# EAGLE schematic Diagrama1 (EAGLE 9.4.2)
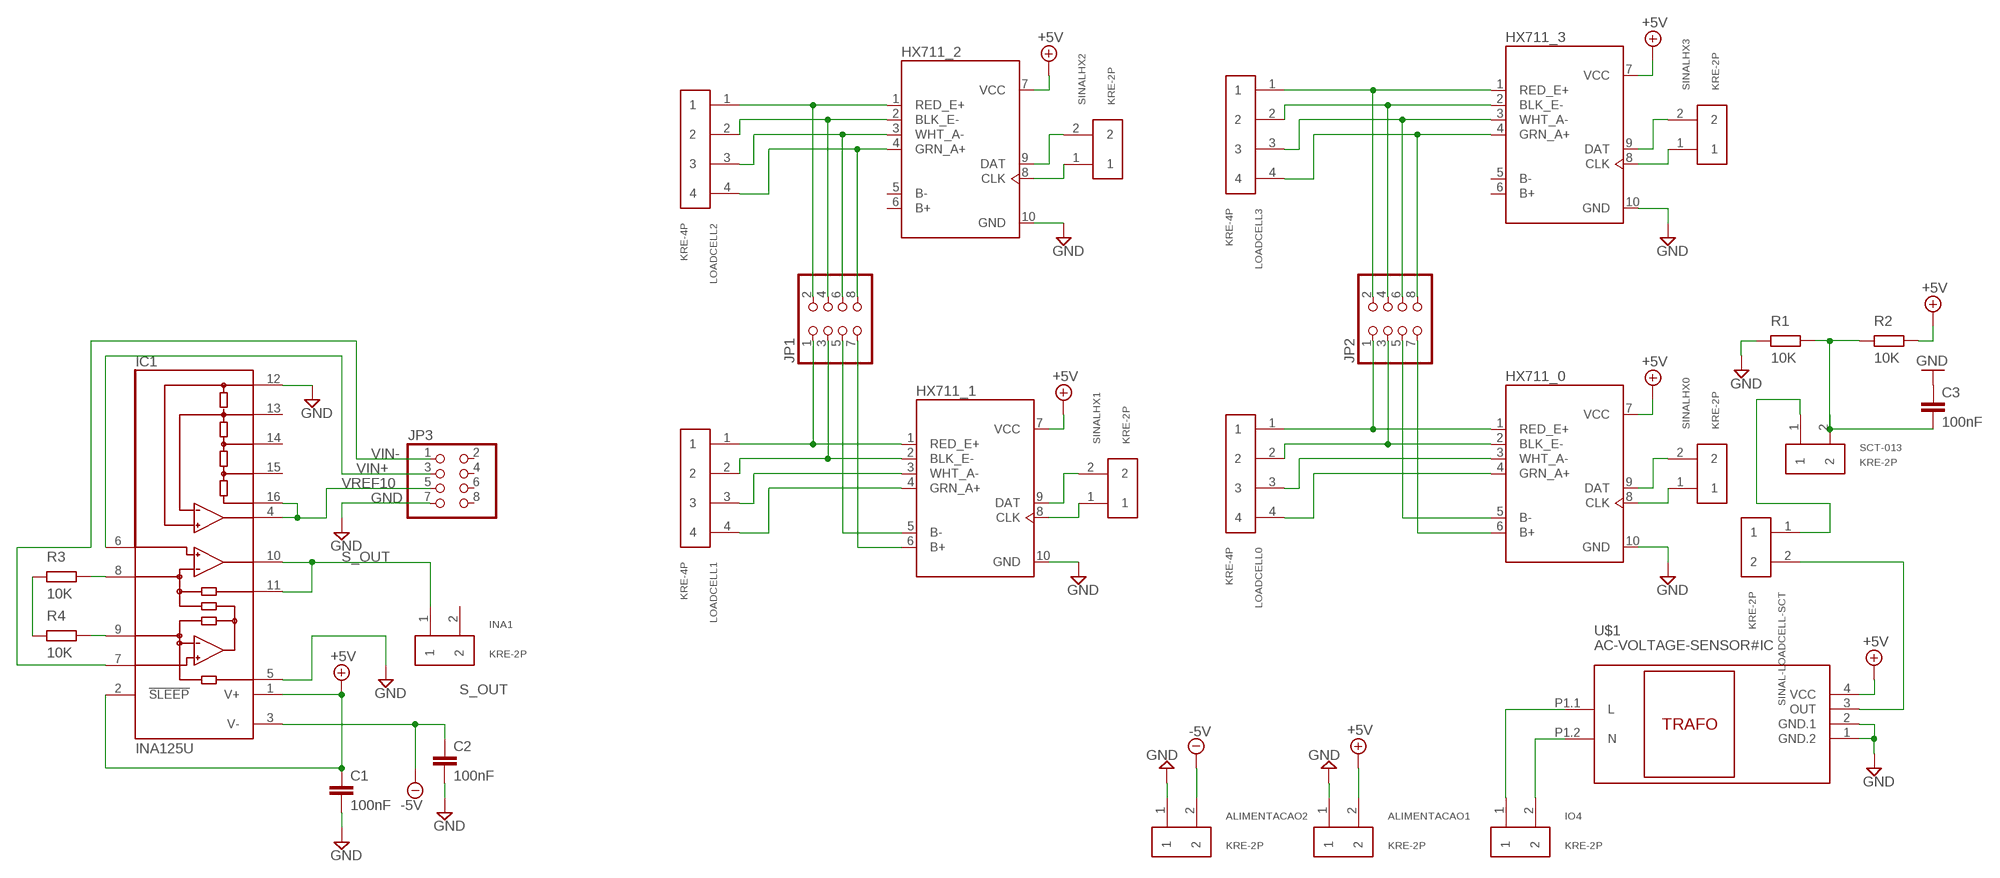
[diagram p0: schematic, sheet 1]

## Parts
ALIMENTACAO1  KRE-2P  [KRE-2P]
ALIMENTACAO2  KRE-2P  [KRE-2P]
C1  100nF  C-EU050-025X075  [C050-025X075]
C2  100nF  C-EU050-025X075  [C050-025X075]
C3  100nF  C-EU050-025X075  [C050-025X075]
HX711_0  HX711MODULO  [HX711MODULO]
HX711_1  HX711MODULO  [HX711MODULO]
HX711_2  HX711MODULO  [HX711MODULO]
HX711_3  HX711MODULO  [HX711MODULO]
IC1  INA125U  [SO16-1]
INA1  KRE-2P  [KRE-2P]
IO4  KRE-2P  [KRE-2P]
JP1  PINHD-2X4  [2X04]
JP2  PINHD-2X4  [2X04]
JP3  PINHD-2X4  [2X04]
LOADCELL0  KRE-4P  [KRE-4P]
LOADCELL1  KRE-4P  [KRE-4P]
LOADCELL2  KRE-4P  [KRE-4P]
LOADCELL3  KRE-4P  [KRE-4P]
R1  10K  1K1/4RESISTOR  [1/4W-0.41K]
R2  10K  1K1/4RESISTOR  [1/4W-0.41K]
R3  10K  1K1/4RESISTOR  [1/4W-0.41K]
R4  10K  1K1/4RESISTOR  [1/4W-0.41K]
SCT-013  KRE-2P  [KRE-2P]
SINAL-LOADCELL-SCT  KRE-2P  [KRE-2P]
SINALHX0  KRE-2P  [KRE-2P]
SINALHX1  KRE-2P  [KRE-2P]
SINALHX2  KRE-2P  [KRE-2P]
SINALHX3  KRE-2P  [KRE-2P]
U$1  AC-VOLTAGE-SENSOR#IC  [AC-VOLTAGE-SENSOR#IC]

## Nets
+5V: ALIMENTACAO1.2 C1.1 HX711_0.7(VCC) HX711_1.7(VCC) HX711_2.7(VCC) HX711_3.7(VCC) IC1.1(V+) IC1.2(!SLEEP) R2.2 U$1.4(VCC)
-5V: ALIMENTACAO2.2 C2.1 IC1.3(V-)
GND: ALIMENTACAO1.1 ALIMENTACAO2.1 C1.2 C2.2 C3.1 HX711_0.10(GND) HX711_1.10(GND) HX711_2.10(GND) HX711_3.10(GND) IC1.5(REF) IC1.12(REFCOM) JP3.7 R1.1 U$1.1(GND.2) U$1.2(GND.1)
N$1: IO4.2 U$1.P1.2(N)
N$2: IO4.1 U$1.P1.1(L)
N$3: HX711_0.1(RED_E+) JP2.1 LOADCELL0.1
N$4: HX711_0.4(GRN_A+) LOADCELL0.4
N$5: HX711_0.2(BLK_E-) JP2.3 LOADCELL0.2
N$6: HX711_1.1(RED_E+) JP1.1 LOADCELL1.1
N$7: HX711_0.3(WHT_A-) LOADCELL0.3
N$8: HX711_1.2(BLK_E-) JP1.3 LOADCELL1.2
N$9: HX711_1.3(WHT_A-) LOADCELL1.3
N$10: C3.2 R1.2 R2.1 SCT-013.2
N$11: HX711_0.9(DAT) SINALHX0.2
N$12: HX711_0.8(CLK) SINALHX0.1
N$13: HX711_1.5(B-) JP1.5
N$14: HX711_1.4(GRN_A+) LOADCELL1.4
N$15: SINAL-LOADCELL-SCT.2 U$1.3(OUT)
N$16: HX711_1.9(DAT) SINALHX1.2
N$17: HX711_1.8(CLK) SINALHX1.1
N$18: HX711_2.1(RED_E+) JP1.2 LOADCELL2.1
N$19: HX711_2.2(BLK_E-) JP1.4 LOADCELL2.2
N$20: HX711_2.3(WHT_A-) JP1.6 LOADCELL2.3
N$21: HX711_2.4(GRN_A+) JP1.8 LOADCELL2.4
N$22: HX711_2.9(DAT) SINALHX2.2
N$23: HX711_2.8(CLK) SINALHX2.1
N$24: HX711_3.1(RED_E+) JP2.2 LOADCELL3.1
N$25: HX711_3.2(BLK_E-) JP2.4 LOADCELL3.2
N$26: HX711_3.3(WHT_A-) JP2.6 LOADCELL3.3
N$27: HX711_3.4(GRN_A+) JP2.8 LOADCELL3.4
N$28: HX711_3.9(DAT) SINALHX3.2
N$29: HX711_3.8(CLK) SINALHX3.1
N$30: SCT-013.1 SINAL-LOADCELL-SCT.1
N$31: HX711_1.6(B+) JP1.7
N$32: HX711_0.5(B-) JP2.5
N$33: HX711_0.6(B+) JP2.7
N$34: R3.1 R4.1
N$35: IC1.9(RG) R4.2
N$36: IC1.8(RG) R3.2
S_OUT: IC1.10(OUT) IC1.11(SENSE) INA1.1
VIN+: IC1.6(+IN) JP3.3
VIN-: IC1.7(-IN) JP3.1
VREF10: IC1.4(REFOUT) IC1.16(REF10) JP3.5
Unconnected: HX711_2.5(B-) HX711_2.6(B+) HX711_3.5(B-) HX711_3.6(B+) IC1.13(REFBG) IC1.14(REF2.5) IC1.15(REF5) INA1.2 JP3.2 JP3.4 JP3.6 JP3.8

## Library data of the parts
ALIMENTACAO1 ALIMENTACAO2 INA1 IO4 SCT-013 SINAL-LOADCELL-SCT SINALHX0 SINALHX1-SINALHX3 = kre:KRE-2P: KRE Conector 2P
C1-C3 = rcl:C-EU: CAPACITOR, European symbol; SPICEPREFIX: C
HX711_0 HX711_1-HX711_3 = minha biblioteca:HX711MODULO: Load Cell Amp Hx711; AVAILABILITY: Unavailable; DESCRIPTION: Load Cell Amp Hx711; MF: SparkFun; MP: SEN-13879; PACKAGE: None; PRICE: None
IC1 = burr-brown-4:INA125: Instrumentation Amplifier with Precision Voltage Reference
JP1-JP3 = pinhead:PINHD-2X4: PIN HEADER
LOADCELL0 LOADCELL1-LOADCELL3 = kre:KRE-4P: KRE Conector 4P
R1-R4 = resistors:1K1/4RESISTOR
U$1 = diy-modules:AC-VOLTAGE-SENSOR#IC: Isolated AC Voltage Sensor based on ZMPT101B transformer Symbol with input connector ZMPT101B Voltage Transformer Operating Guide is available here: http://www.zeming-e.com/file/0_2013_10_18_093344.pdf Click here to find device on ebay.com <http://www.ebay.com/sch/arduino+voltage+transformer>